# EAGLE design Hutschienen-Shield (EAGLE 8.7.1)
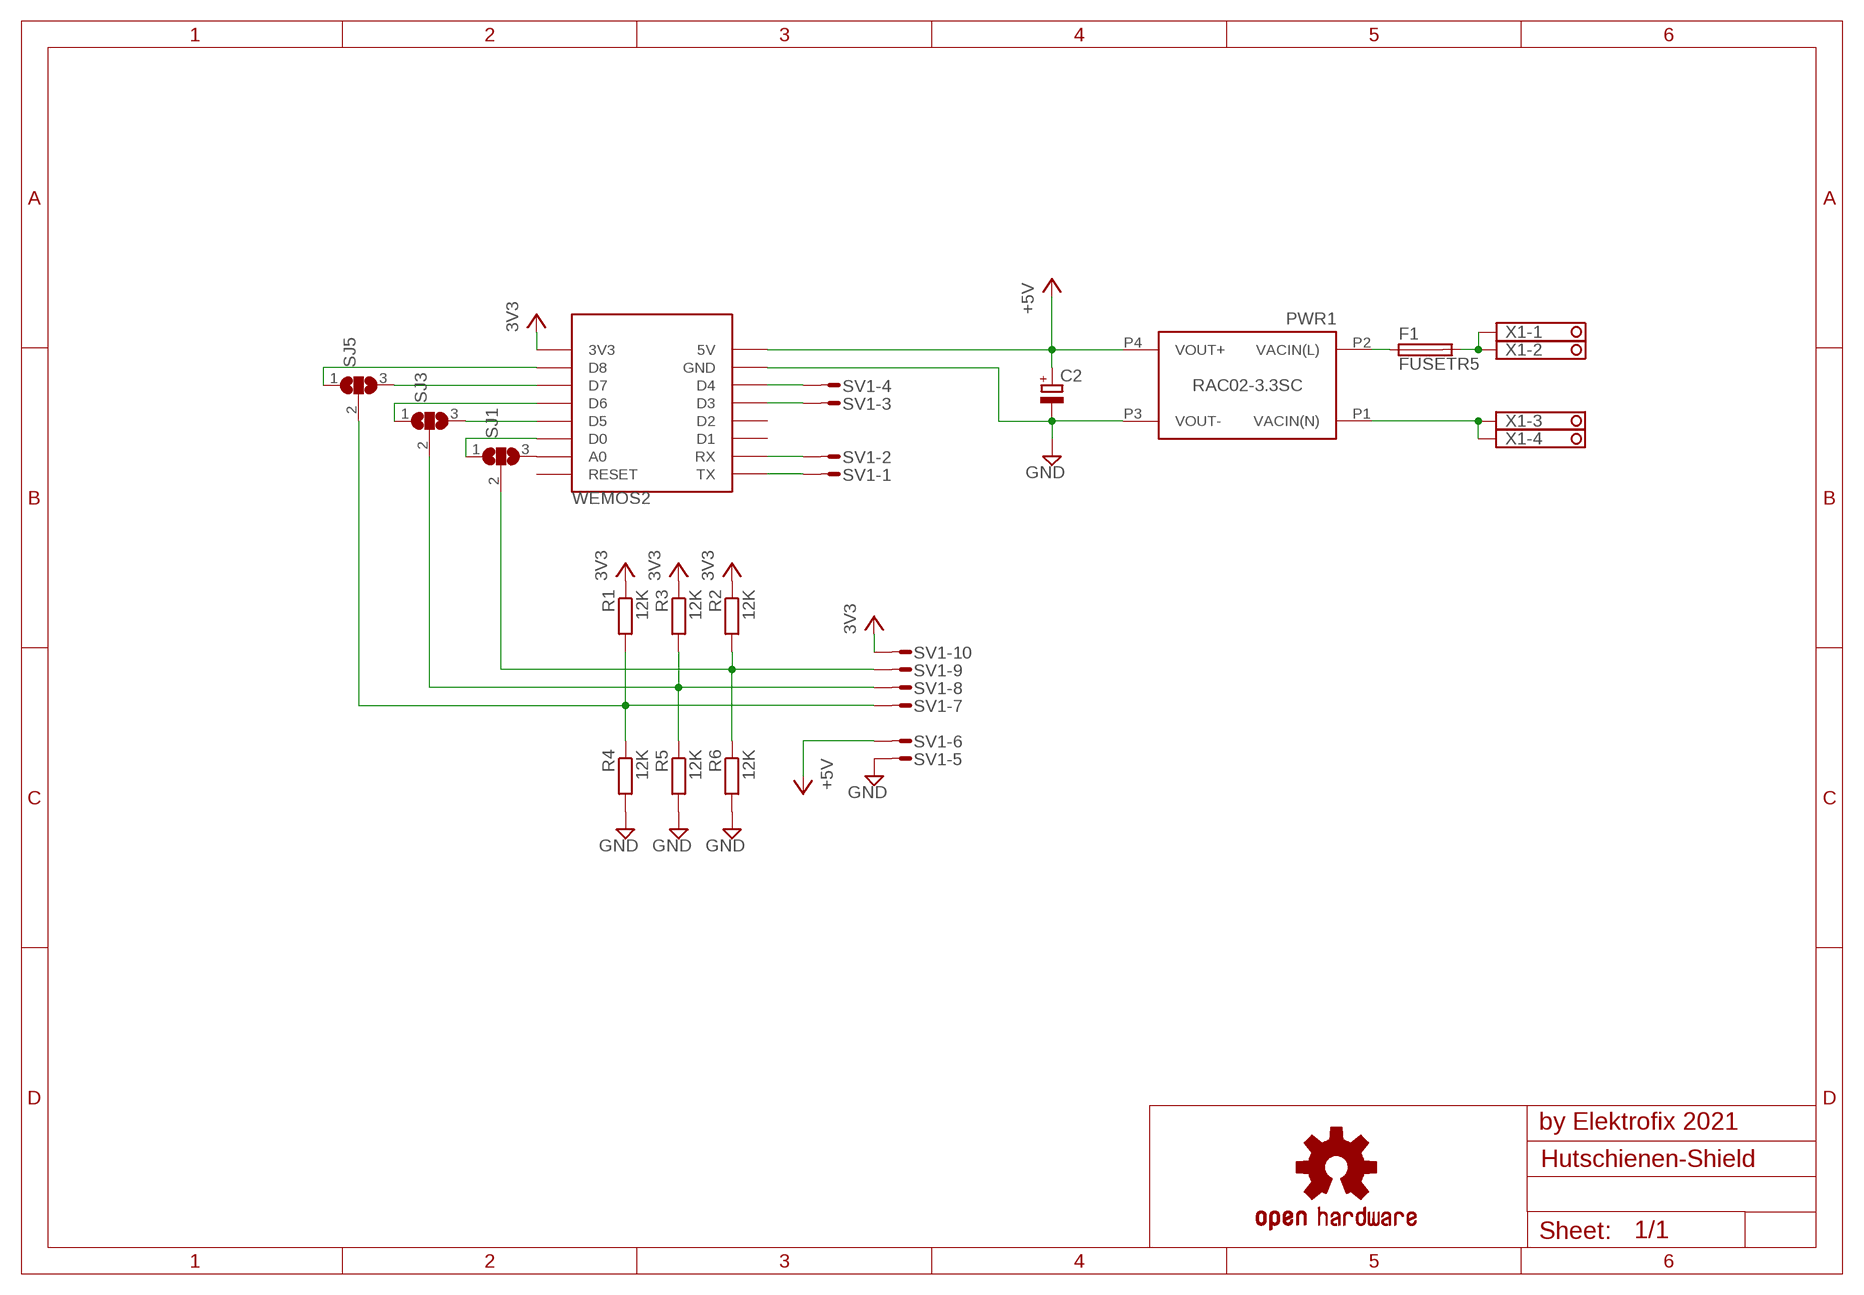
[diagram p0: schematic, sheet 1]

## Parts
C2  CPOL-EUE3.5-8  [E3,5-8]
F1  FUSETR5  [TR5]
LOGO1  OSHW-LOGOL  [OSHW-LOGO-L]
PWR1  RAC02-3.3SC  [LOW_PROFILE_POWER_MODULE]
R1  12K  R-EU_0207/12  [0207/12]
R2  12K  R-EU_0207/12  [0207/12]
R3  12K  R-EU_0207/12  [0207/12]
R4  12K  R-EU_0207/12  [0207/12]
R5  12K  R-EU_0207/12  [0207/12]
R6  12K  R-EU_0207/12  [0207/12]
SJ1  SJ2W  [SJ_2]
SJ3  SJ2W  [SJ_2]
SJ5  SJ2W  [SJ_2]
SV1  L10P  [L10P]
WEMOS2  WEMOS-D1-MINI  [WEMOS-D1-MINI]
X1  1751264  [1751264]

## Nets
3V3: R1.1 R2.1 R3.1 SV1.10 WEMOS2.3V3
+5V: C2.+ PWR1.P4(VOUT+) SV1.6 WEMOS2.5V
GND: C2.- PWR1.P3(VOUT-) R4.2 R5.2 R6.2 SV1.5 WEMOS2.GND
N$1: F1.1 PWR1.P2(VACIN(L))
N$2: F1.2 X1.1 X1.2
N$3: PWR1.P1(VACIN(N)) X1.3 X1.4
N$4: SV1.4 WEMOS2.D4
N$5: SV1.3 WEMOS2.D3
N$6: SV1.1 WEMOS2.TX
N$7: SV1.2 WEMOS2.RX
N$8: SJ1.3 WEMOS2.A0
N$9: SJ1.1 WEMOS2.D0
N$10: SJ3.3 WEMOS2.D5
N$11: SJ3.1 WEMOS2.D6
N$12: SJ5.3 WEMOS2.D7
N$13: SJ5.1 WEMOS2.D8
N$14: R2.2 R6.1 SJ1.2 SV1.9
N$15: R3.2 R5.1 SJ3.2 SV1.8
N$16: R1.2 R4.1 SJ5.2 SV1.7
Unconnected: WEMOS2.D1 WEMOS2.D2 WEMOS2.RESET

## Notes on the sheet
- by Elektrofix 2021

## Library data of the parts
C2 = rcl:CPOL-EU: POLARIZED CAPACITOR, European symbol; SPICEPREFIX: C
F1 = fuse:FUSE: Fuse; OC_FARNELL: unknown; OC_NEWARK: unknown
LOGO1 = SparkFun-Aesthetics:OSHW-LOGO: Open-Source Hardware (OSHW) Logo This logo indicates the piece of hardware it is found on incorporates a OSHW license and/or adheres to the definition of open source hardware found here: http://freedomdefined.org/OSHW
PWR1 = recom-powerline-acdc-converters:RAC*SC: RECOM POWERLINE AC/DC-Converter (RAC01-SC and RAC02-SC series) The RAC01-SC and RAC02-SC series are ultra-compact universal input AC/DC power modules for PCB mounting. They feature high efficiency, low standby power, high operating temperature, soft start and short-circuit protection as well as a built-in EMC Class B filter. Output voltages range from 3.3VDC to 24VDC. Datasheet <http://www.recom-power.com/pdf/Powerline-AC-DC/RAC01_02-SC.pdf>; INPUT_RANGE: 80 - 277 (VAC); MAX_CAPACITIVE_LOAD: 2000uF; OUTPUT_CURRENT: 600mA; OUTPUT_VOLTAGE: 3.3v
R1-R6 = resistor:R-EU_: RESISTOR, European symbol
SJ1 SJ3 SJ5 = jumper:SJ2W: SMD solder JUMPER
SV1 = con-amp-mt:L10P: AMP MT CONNECTOR; OC_FARNELL: unknown; OC_NEWARK: unknown
WEMOS2 = esp8266modules:WEMOS-D1-MINI: WeMos.cc D1 mini ESP8266 module
X1 = con-phoenix-350:1751264: MKDS 1/ 4-3,5 Printklemme Nennstrom: 10 A Bemessungsspannung: 160 V Raster: 3,5 mm Polzahl: 4 Montageart: Löten Anschlussart: Schraubanschluss Anschlussrichtung vom Leiter zur Platine: 0° Source: http://eshop.phoenixcontact.com .. 1751264.pdf; MPN: 1751264; OC_FARNELL: unknown; OC_NEWARK: 10R0934

## Board
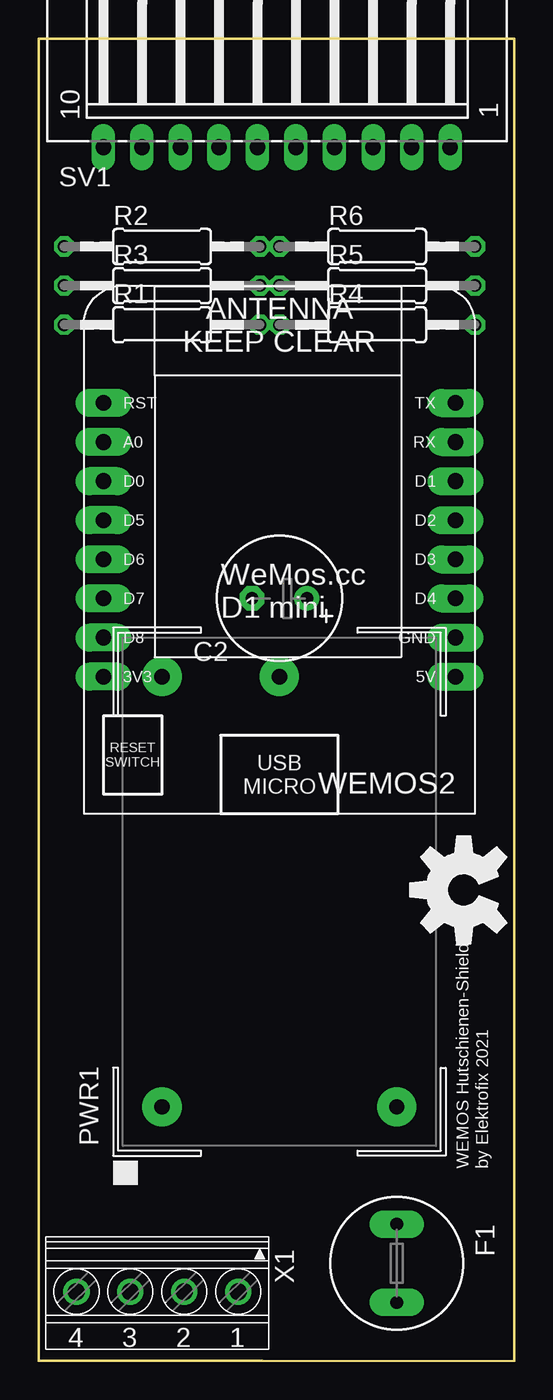
[diagram p1: board, top side]
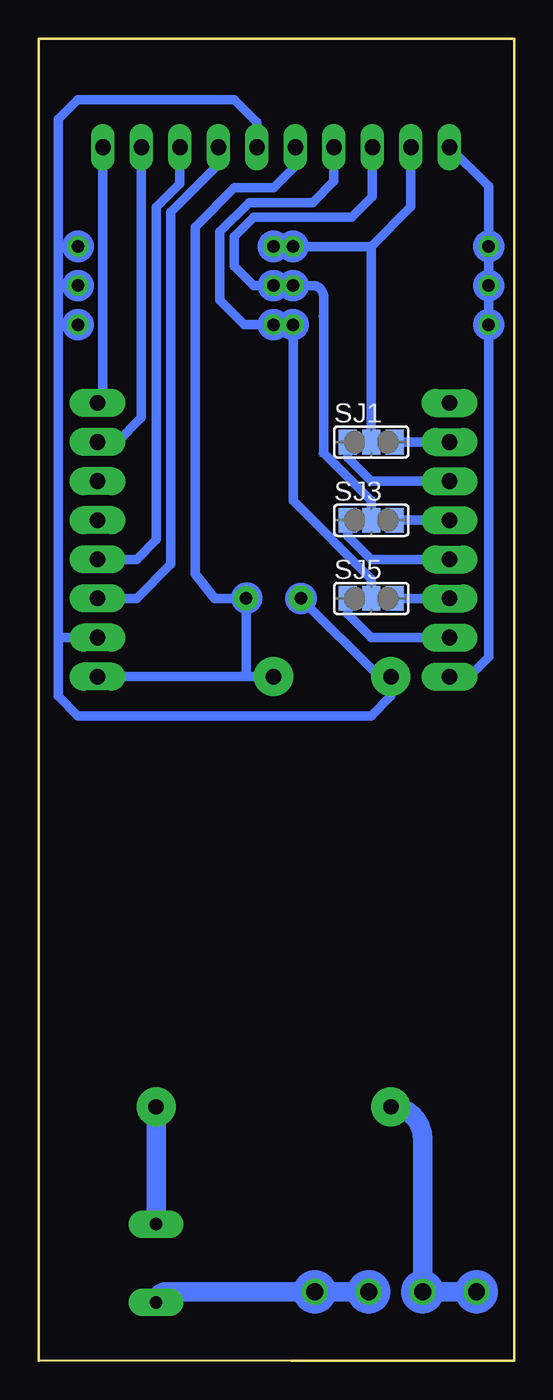
[diagram p2: board, bottom side, seen from below]

Size 30.9 x 85.9 mm. Coordinates in mm from the lower left corner, seen from the top.
Outline: 14.5,0 0.01,0
Outline: 0,0 30.9,0 30.9,85.9 0,85.9 0,0
Copper layers (1*16): Top 0.035mm / dielectric 1.5mm / Bottom 0.035mm
Design rules "default": minimum track width 6mil, minimum drill 0.35mm, track to track 6mil, track to pad 6mil, pad to pad 6mil, via to via 6mil, smd to smd 6mil, copper to edge 40mil, drill to drill 6mil, minimum pad ring 10mil, minimum via ring 8mil, stop-mask expansion 4mil, vias tented up to drill 0mil, thermal gap 10mil

### Footprints (pad centres in the part's own frame; a part is rotated, then mirrored left to right if it is on the bottom)
E3,5-8 = drill 0.813 pad 1.6: + -1.778,0 | drill 0.813 pad 1.6 octagon: - 1.778,0
TR5 = drill 0.813 pad 1.778 long: 1 -2.54,0; 2 2.54,0
LOW_PROFILE_POWER_MODULE = drill 1 pad 2.54: P1 -12.7,7.62; P2 -12.7,-7.62; P3 15.24,7.62; P4 15.24,0
0207/12 = drill 0.813 octagon: 1 -6.35,0; 2 6.35,0
SJ_2 = smd 1.168 x 1.6: 1 -1.524,0; 2 0,0; 3 1.524,0
L10P = drill 1.016 long: 1 11.25,-6.25; 2 8.75,-6.25; 3 6.25,-6.25; 4 3.75,-6.25; 5 1.25,-6.25; 6 -1.25,-6.25; 7 -3.75,-6.25; 8 -6.25,-6.25; 9 -8.75,-6.25; 10 -11.25,-6.25
WEMOS-D1-MINI = drill 1.016 pad 1.829 long: 3V3 -10.16,-10.16; 5V 12.7,-10.16; A0 -10.16,5.08; D0 -10.16,2.54; D1 12.7,2.54; D2 12.7,0; D3 12.7,-2.54; D4 12.7,-5.08; D5 -10.16,0; D6 -10.16,-2.54; D7 -10.16,-5.08; D8 -10.16,-7.62; GND 12.7,-7.62; RESET -10.16,7.62; RX 12.7,5.08; TX 12.7,7.62
1751264 = drill 1.1 pad 1.7: 1 -5.25,-0.1; 2 -1.75,-0.1; 3 1.75,-0.1; 4 5.25,-0.1

### Placement (x,y rotation side)
C2  15.64,49.53 180 top
F1  23.26,6.35 270 top
LOGO1  27.61,30.6 90 top
PWR1  15.64,29.21 90 top
R1  8.02,67.31 0 top
R2  8.02,72.39 0 top
R3  8.02,69.85 0 top
R4  21.99,67.31 0 top
R5  21.99,69.85 0 top
R6  21.99,72.39 0 top
SJ1  9.29,59.69 0 bottom
SJ3  9.29,54.61 0 bottom
SJ5  9.29,49.53 0 bottom
SV1  15.47,85.09 0 top
WEMOS2  14.37,54.61 0 top
X1  7.71,4.41 180 top

### Tracks (layer width: path | path; a pad name or v marks a point on that pad's centre or on a via)
3V3
  Bottom 0.61: WEMOS2.3V3 2.94,44.45 1.67,45.72 R1.1 R3.1 R2.1 1.67,76.29 SV1.10
+5V
  Bottom 0.61: WEMOS2.5V 17.42,44.45 | 17.42,44.45 PWR1.P4 | 17.42,44.45 C2.+ 19.45,49.53 20.72,51.12 20.72,73.66 18.18,76.2 15.64,76.2 14.22,77.62 SV1.6
GND
  Bottom 0.61: C2.- 8.78,44.45 PWR1.P3 8.02,43.18 9.29,41.91 28.34,41.91 29.61,43.18 29.61,46.99 | 28.34,46.99 WEMOS2.GND 29.61,46.99 | R4.2 29.61,67.31 | R5.2 29.61,69.85 | 29.61,69.85 29.61,67.31 | 29.61,72.39 29.61,69.85 | R6.2 29.61,72.39 | 29.61,67.31 29.61,46.99 | SV1.5 16.72,80.45 18.18,81.92 28.34,81.92 29.61,80.64 29.61,72.39
N$1
  Bottom 1.27: F1.1 PWR1.P2
N$2
  Bottom 1.27: X1.2 X1.1 22.57,4.5 arc-90 F1.2
N$3
  Bottom 1.27: X1.4 X1.3 5.96,14.45 arc-90 PWR1.P1
N$4
  Bottom 0.61: SV1.4 19.22,77.7 22.31,74.61 22.31,51.75 24.53,49.53 WEMOS2.D4
N$5
  Bottom 0.61: SV1.3 21.72,76.47 23.26,74.93 23.26,53.34 24.53,52.07 WEMOS2.D3
N$6
  Bottom 0.61: SV1.1 26.72,62.58 WEMOS2.TX
N$7
  Bottom 0.61: SV1.2 24.22,61.27 25.8,59.69 WEMOS2.RX
N$8
  Bottom 0.61: SJ1.3 WEMOS2.A0
N$9
  Bottom 0.61: SJ1.1 10.81,58.67 9.29,57.15 WEMOS2.D0
N$10
  Bottom 0.61: SJ3.3 WEMOS2.D5
N$11
  Bottom 0.61: SJ3.1 10.81,53.59 9.29,52.07 WEMOS2.D6
N$12
  Bottom 0.61: SJ5.3 WEMOS2.D7
N$13
  Bottom 0.61: SJ5.1 10.81,48.51 9.29,46.99 WEMOS2.D8
N$14
  Bottom 0.61: 9.29,72.39 R2.2 R6.1 | SJ1.2 9.29,72.39 | SV1.9 6.72,74.96 9.29,72.39
N$15
  Bottom 0.61: SJ3.2 9.29,55.88 12.39,58.98 | 12.39,58.98 12.4,58.98 | 12.39,58.98 12.39,67.84 | 12.39,67.84 12.4,67.86 | 12.39,67.84 12.39,69.14 arc-90 13.1,69.85 R3.2 R5.1 16.91,69.85 18.18,71.12 18.18,73.03 16.91,74.3 10.56,74.3 9.22,75.64 SV1.8
N$16
  Bottom 0.61: SJ5.2 9.29,50.8 14.37,55.88 R1.2 R4.1 17.55,67.31 19.13,68.9 19.13,73.34 17.23,75.25 13.1,75.25 11.72,76.63 SV1.7
(copper drawn outside any net)
  shapes: Bottom circle x18

### Text on the board
tPlace: WEMOS Hutschienen-Shield | by Elektrofix 2021